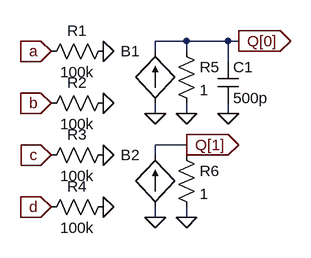
[diagram p0: schematic priority_encoder_2bit.asc]
priority_encoder_2bit.asc, the LTspice schematic file:
Version 4
SHEET 1 880 680
WIRE 272 80 224 80
WIRE 336 80 272 80
WIRE 352 80 336 80
WIRE 224 96 224 80
WIRE 272 96 272 80
WIRE 336 112 336 80
WIRE 224 192 224 176
WIRE 272 192 272 176
WIRE 336 192 336 176
WIRE 272 240 224 240
WIRE 224 256 224 240
WIRE 272 256 272 240
WIRE 224 352 224 336
WIRE 272 352 272 336
FLAG 64 96 a
IOPIN 64 96 In
FLAG 144 96 0
FLAG 64 176 b
IOPIN 64 176 In
FLAG 144 176 0
FLAG 64 256 c
IOPIN 64 256 In
FLAG 144 256 0
FLAG 64 336 d
IOPIN 64 336 In
FLAG 144 336 0
FLAG 224 192 0
FLAG 272 192 0
FLAG 352 80 Q[0]
IOPIN 352 80 Out
FLAG 224 352 0
FLAG 272 352 0
FLAG 272 240 Q[1]
IOPIN 272 240 Out
FLAG 336 192 0
SYMBOL res 160 80 R90
WINDOW 0 0 56 VBottom 2
WINDOW 3 32 56 VTop 2
SYMATTR InstName R1
SYMATTR Value 100k
SYMBOL res 160 160 R90
WINDOW 0 0 56 VBottom 2
WINDOW 3 32 56 VTop 2
SYMATTR InstName R2
SYMATTR Value 100k
SYMBOL res 160 240 R90
WINDOW 0 0 56 VBottom 2
WINDOW 3 32 56 VTop 2
SYMATTR InstName R3
SYMATTR Value 100k
SYMBOL res 160 320 R90
WINDOW 0 0 56 VBottom 2
WINDOW 3 32 56 VTop 2
SYMATTR InstName R4
SYMATTR Value 100k
SYMBOL bi 224 176 R180
WINDOW 0 24 80 Left 2
WINDOW 3 24 0 Invisible 2
SYMATTR InstName B1
SYMATTR Value I=!V(a)&( V(b) | ( !V(c)&V(d) ) )
SYMBOL res 256 80 R0
SYMATTR InstName R5
SYMATTR Value 1
SYMBOL res 256 240 R0
SYMATTR InstName R6
SYMATTR Value 1
SYMBOL bi 224 336 R180
WINDOW 0 24 80 Left 2
WINDOW 3 24 0 Invisible 2
SYMATTR InstName B2
SYMATTR Value I=!V(a)&!V(b)&( V(c) | V(d) )
SYMBOL cap 320 112 R0
SYMATTR InstName C1
SYMATTR Value 500p

The netlist it stands for:
* priority_encoder_2bit.asc
R1 0 a 100k
R2 0 b 100k
R3 0 c 100k
R4 0 d 100k
B1 0 Q[0] I=!V(a)&( V(b) | ( !V(c)&V(d) ) )
R5 Q[0] 0 1
R6 Q[1] 0 1
B2 0 Q[1] I=!V(a)&!V(b)&( V(c) | V(d) )
C1 Q[0] 0 500p
.backanno
.end